# Altium project nPOC-BB_alpha_main-board.PrjPcb (part 2 of 3)

## Sheet Power Supplies.SchDoc: Power Supplies
size 431 x 279 mm; DrawnBy: DD; DocumentNumber: GHL-1-21002; Revision: A; SheetNumber: 4; SheetTotal: 7; ProjectID: 263-03
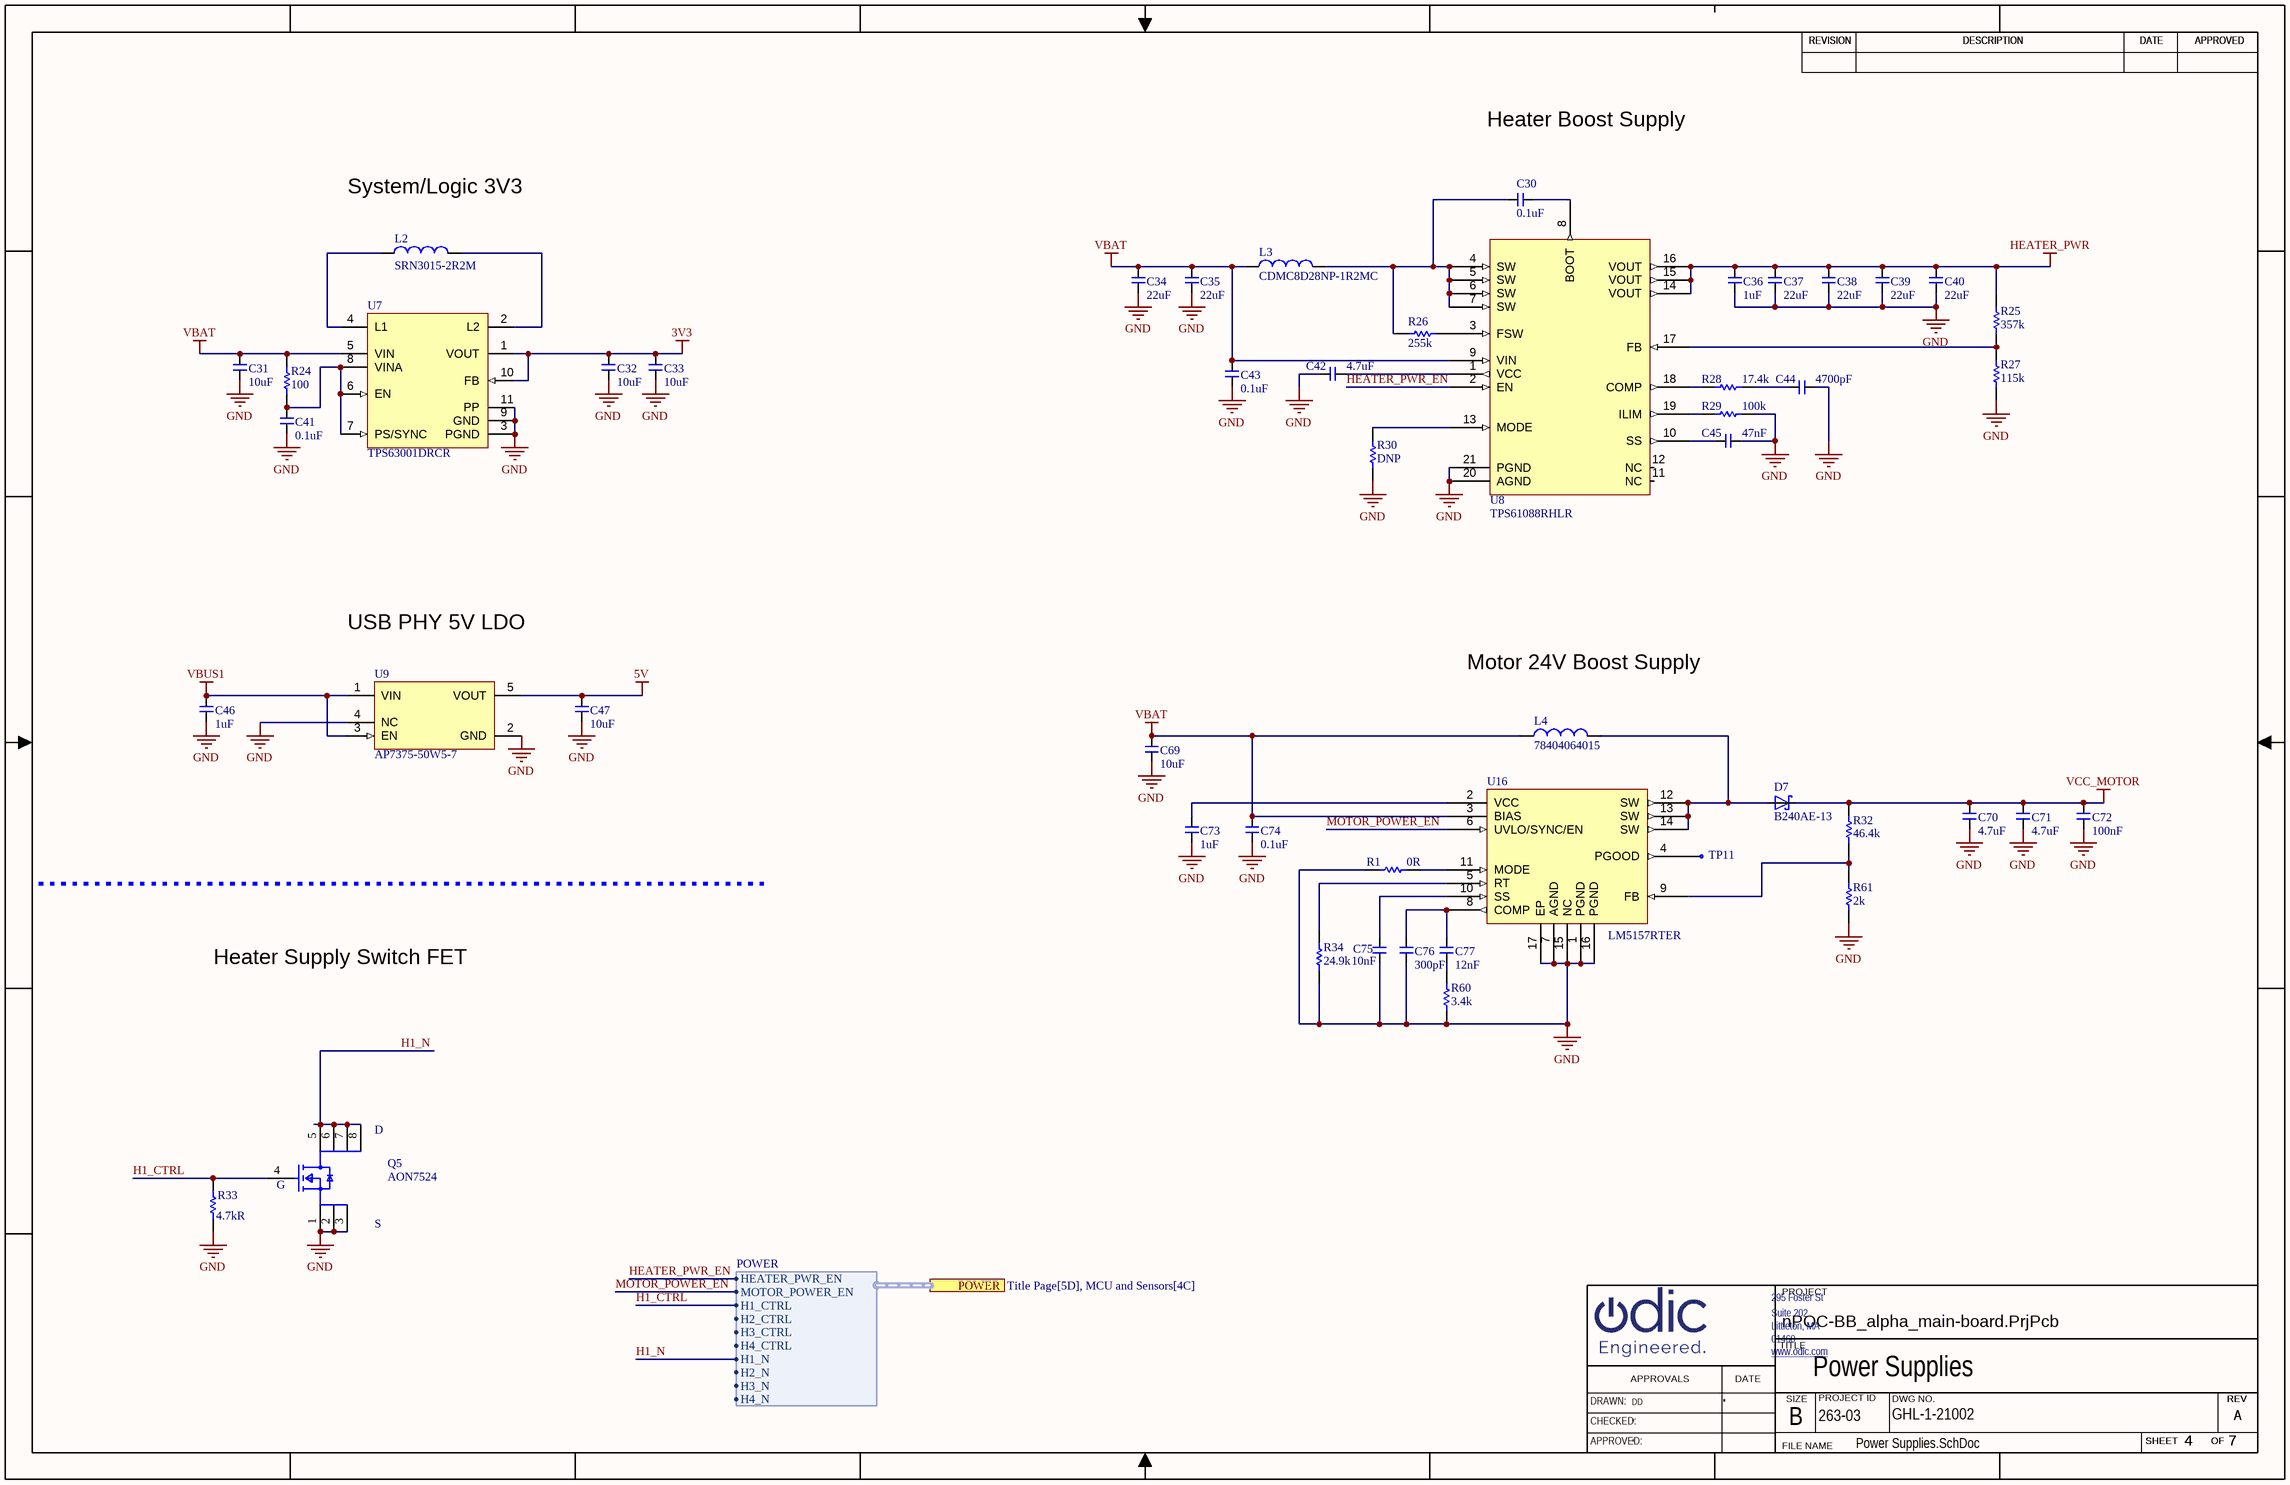
[diagram p4: Power Supplies.SchDoc]

### Parts
C30  0.1uF  [C0402]
C31  10uF  [C0603]
C32  10uF  [C0402]
C33  10uF  [C0402]
C34  22uF  [c0805]
C35  22uF  [c0805]
C36  1uF  [C0603]
C37  22uF  [c0805]
C38  22uF  [c0805]
C39  22uF  [c0805]
C40  22uF  [c0805]
C41  0.1uF  [C0402]
C42  4.7uF  [C0402]
C43  0.1uF  [C0402]
C44  4700pF  [C0402]
C45  47nF  [C0402]
C46  1uF  [C0603]
C47  10uF  [C0402]
C69  10uF  [C0603]
C70  4.7uF  [c0805]
C71  4.7uF  [c0805]
C72  100nF  [C0603]
C73  1uF  [C0603]
C74  0.1uF  [c0805]
C75  value 10nF  [C0402]  (hidden comment: C0402_10n_35V_10pct)
C76  300pF  [C0402]
C77  12nF  [C0402]
D7  B240AE-13  [sma]
L2  SRN3015-2R2M  [IND_BOURNS_SRN3015]
L3  CDMC8D28NP-1R2MC  [ind2_9p5x8p5mm]
L4  78404064015  [ind2_wurth_78404064015]
Q5  AON7524  [dfn8_3x3_p65mm_fet]
R1  0R  [R0402]
R24  100  [R0402]
R25  357k  [R0402]
R26  255k  [R0402]
R27  115k  [R0402]
R28  17.4k  [R0402]
R29  100k  [R0402]
R30  DNP  [R0402]
R32  46.4k  [R0402]
R33  Resistance: 4.7kR  [R0402]  (hidden comment: R0402_4k7_1pct)
R34  24.9k  [R0402]
R60  3.4k  [R0402]
R61  2k  [R0402]
TP11  TPC30  [tpc30]  (value not drawn)
U7  TPS63001DRCR  [dfn10_3x3_p5mm_1mm]
U8  TPS61088RHLR  [qfn20_3p5x4p5_p5mm]
U9  AP7375-50W5-7  [SOT25]
U16  LM5157RTER  [qfn16_3x3_p5mm_thpad]

### Ports
POWER (harness POWER, see Title Page[5D], MCU and Sensors[4C])

### Harnesses
POWER: HEATER_PWR_EN, H1_CTRL, H2_CTRL, H3_CTRL, H4_CTRL, H1_N, H2_N, H3_N, H4_N, MOTOR_POWER_EN

### Nets
3V3: C32.2 C33.2 U7.1(VOUT) U7.10(FB)
5V: C47.2 U9.5(VOUT)
GND: C31.1 C32.1 C33.1 C34.1 C35.1 C36.1 C37.1 C38.1 C39.1 C40.1 C41.1 C42.1 C43.1 C44.2 C45.2 C46.1 C47.1 C69.1 C70.1 C71.1 C72.1 C73.1 C74.1 C75.1 C76.1 Q5.1(S) Q5.2(S) Q5.3(S) R1.1 R27.1 R29.2 R30.1 R33.1 R34.1 R60.1 R61.1 U7.3(PGND) U7.9(GND) U7.11(PP) U8.20(AGND) U8.21(PGND) U9.2(GND) U9.4(NC) U16.1(PGND) U16.7(AGND) U16.15(NC) U16.16(PGND) U16.17(EP)
HEATER_PWR: C36.2 C37.2 C38.2 C39.2 C40.2 R25.2 U8.14(VOUT) U8.15(VOUT) U8.16(VOUT)  [project net HEATER_P]
VBAT: C31.2 C34.2 C35.2 C43.2 C69.2 C74.2 L3.1 L4.1 R24.2 U7.5(VIN) U8.9(VIN) U16.3(BIAS)
VBUS1: C46.2 U9.1(VIN) U9.3(EN)
VCC_MOTOR: C70.2 C71.2 C72.2 D7.K R32.2
H1_CTRL: Q5.4(G) R33.2 ; port POWER.H1_CTRL
H1_N: Q5.5(D) Q5.6(D) Q5.7(D) Q5.8(D) ; port POWER.H1_N
HEATER_PWR_EN: U8.2(EN) ; port POWER.HEATER_PWR_EN
MOTOR_POWER_EN: U16.6(UVLO/SYNC/EN) ; port POWER.MOTOR_POWER_EN
NetC30_1: C30.1 U8.8(BOOT)
NetC30_2: C30.2 L3.2 R26.1 U8.4(SW) U8.5(SW) U8.6(SW) U8.7(SW)
NetC41_2: C41.2 R24.1 U7.6(EN) U7.7(PS/SYNC) U7.8(VINA)
NetC42_2: C42.2 U8.1(VCC)
NetC44_1: C44.1 R28.2
NetC45_1: C45.1 U8.10(SS)
NetC73_2: C73.2 U16.2(VCC)
NetC75_2: C75.2 U16.10(SS)
NetC76_2: C76.2 C77.2 U16.8(COMP)
NetC77_1: C77.1 R60.2
NetD7_A: D7.A L4.2 U16.12(SW) U16.13(SW) U16.14(SW)
NetL2_1: L2.1 U7.4(L1)
NetL2_2: L2.2 U7.2(L2)
NetR1_2: R1.2 U16.11(MODE)
NetR25_1: R25.1 R27.2 U8.17(FB)
NetR26_2: R26.2 U8.3(FSW)
NetR28_1: R28.1 U8.18(COMP)
NetR29_1: R29.1 U8.19(ILIM)
NetR30_2: R30.2 U8.13(MODE)
NetR32_1: R32.1 R61.2 U16.9(FB)
NetR34_2: R34.2 U16.5(RT)
NetTP11_1: TP11.1 U16.4(PGOOD)

Not connected (* = marked no-connect by the designer): U8 11(NC) 12(NC)

### Notes on the sheet
- Heater Boost Supply
- System/Logic 3V3
- USB PHY 5V LDO
- Motor 24V Boost Supply
- Heater Supply Switch FET
- REVISION
- DESCRIPTION
- DATE
- APPROVED
- 295 Foster St
- PROJECT
- www.odic.com <http://www.odic.com>
- Littleton, MA
- 01460
- Suite 202
- TITLE
- DRAWN:
- CHECKED:
- APPROVALS
- SIZE
- B
- PROJECT ID
- DWG NO.
- SHEET
- OF
- REV
- APPROVED:
- FILE NAME

### Library data of the parts
C30 C43 = CMP-00446-1: Ceramic capacitor SMD 0402 100nF 16V X7R 10%; Install: POP; Voltage: 16V; Mounting Technology: Surface Mount; Width: 0.02inch; Case Code (Metric): 1005; Package Quantity: 1; Depth: 0.5mm; RoHS Compliant: Yes; Length: 1mm; Tolerance: 10%; Value: 100nF; Radiation Hardening: No; Contact Plating: Tin; Packaging: Tape and Reel; Voltage Rating (DC): 16V; Thickness: 0.022inch; Case Code (Imperial): 0402; Case/Package: 0402; Min Operating Temperature: -55°C; Max Operating Temperature: 125°C; Voltage Rating: 16V; Height: 0.5mm; Series: CL; Material: Ceramic; Construction: Flat; Lead Free: Lead Free; Dielectric: X7R
C31 C69 = CMP-00294-2: Cap Ceramic 10uF 35V X5R 20% Pad SMD 0603 85C T/R; Install: POP; Case Code (Metric): 1608; Length: 0.063inch; Case Code (Imperial): 0603; Thickness: 0.039inch; Width: 0.031inch; RoHS Compliant: Yes; Voltage Rating: 35V; Dielectric: X5R; Series: GRM; Case/Package: 0603; Voltage Rating (DC): 35V; Mount: Surface Mount; Capacitance: 10uF; Tolerance: 20%; Max Operating Temperature: 85°C; Packaging: Cut Tape; Min Operating Temperature: -55°C
C32 C33 = CMP-00337-1: Cap Ceramic 10uF 6.3V X5R 20% SMD 0402 85°C Paper T/R; Install: POP; Mount: Surface Mount; Construction: Flat; Case Code (Imperial): 0402; Case/Package: 0402; Series: CL; Package Quantity: 1; Width: 0.02inch; Dielectric: X5R; Radiation Hardening: No; Case Code (Metric): 1005; Capacitance: 10uF; RoHS Compliant: Yes; Depth: 0.5mm; Height: 0.5mm; Packaging: Tape and Reel; Min Operating Temperature: -55°C; Tolerance: 20%; Voltage Rating: 6.3V; Max Operating Temperature: 85°C; Thickness: 0.028inch; Length: 1mm
C34 C35 C37-C40 = CMP-00654-4: Multilayer Ceramic Capacitor, 22 uF, 25 V, ± 20%, X5R, 0805 [2012 Metric]; Install: POP; RoHS Compliant: Yes; Capacitance: 22uF
C36 C46 = CMP-001-00011-1: Multilayer Ceramic Capacitors MLCC - SMD/SMT 1uF 50V 0603 RoHS; Tolerance: 10%; Install: POP; Dielectric: X5R; Max Operating Temperature: 85°C; Packaging: Tape and Reel; Termination: SMD/SMT; Width: 0.031inch; Voltage Rating (DC): 50V; Length: 0.063inch; Halogen Free: Halogen Free; Case/Package: 0603; Package Quantity: 4000; Lead Free: Lead Free; Voltage Rating: 50V; Resistor Type: Ceramic; Value: 1uF; Thickness: 0.035inch; Weight: 7.1E-05oz; Min Operating Temperature: -55°C; Case Code (Metric): 1608; Case Code (Imperial): 0603; Mounting Technology: Surface Mount; RoHS Compliant: Yes; Series: CC
C41 = CMP-00369-1: Cap Ceramic 0.1uF 25V X5R 10% Pad SMD 0402 Multi Layer Ceramic Capacitor (MLCC); Capacitance: 100nF; Install: POP; Packaging: Tape and Reel; Construction: Flat; Max Operating Temperature: 85°C; Case Code (Metric): 1005; Voltage Rating (DC): 25V; Min Operating Temperature: -55°C; Height: 0.5mm; Series: CL; Case/Package: 0402; Voltage: 25V; Package Quantity: 1; Radiation Hardening: No; Depth: 0.5mm; Thickness: 0.022inch; Lead Free: Lead Free; Tolerance: 10%; Length: 1mm; Mount: Surface Mount; Width: 0.02inch; Dielectric: X5R; RoHS Compliant: Yes; Voltage Rating: 25V; Case Code (Imperial): 0402
C42 = CMP-00316-1: Cap Ceramic 4.7uF 10V X5R 20% SMD 0402 85°C Paper T/R; Install: POP; Width: 0.02inch; Package Quantity: 10000; Min Operating Temperature: -55°C; Mount: Surface Mount; Case Code (Imperial): 0402; Case/Package: 0402; Capacitance: 4.7uF; Series: CL; Packaging: Cut Tape; Length: 0.039inch; Dielectric: X5R; Voltage Rating: 10V; Thickness: 0.022inch; Tolerance: 20%; Max Operating Temperature: 85°C; RoHS Compliant: Yes; Case Code (Metric): 1005; Lead Free: Lead Free
C44 = CMP-00374-1: 0402 4.7 nF 25 V ±10 % Tolerance X7R SMT Multilayer Ceramic Capacitor; Tolerance: 10%; Voltage Rating: 25V; Install: POP; Insulation Resistance: 100GR; Capacitance: 4.7nF; Halogen Free: Halogen Free; Weight: 2.3E-05oz; Length: 1mm; Number of Pins: 2; Dielectric: X7R; Radiation Hardening: No; Depth: 0.5mm; Mount: Surface Mount; Min Operating Temperature: -55°C; Thickness: 0.022inch; Max Operating Temperature: 125°C; Dielectric Material: Ceramic; Height: 0.5mm; RoHS Compliant: Yes; Package Quantity: 1; Lead Free: Lead Free; Case Code (Metric): 1005; Voltage Rating (DC): 25V; Case/Package: 0402; Reach SVHC Compliant: Yes; Termination: SMD/SMT; Width: 0.5mm; Resistor Type: Ceramic; Packaging: Tape and Reel; Case Code (Imperial): 0402; Series: CC; Construction: Flat
C45 = CMP-00644-3: CGA2B3X7R1H473K050BB; Voltage Rating: 50V; Tolerance: 10%; Install: POP; Dielectric: X7R; Voltage Rating (DC): 50V; Package Quantity: 1; Width: 0.02inch; Mount: Surface Mount; Case/Package: 0402; Case Code (Metric): 1005; Depth: 0.5mm; Thickness: 0.022inch; Case Code (Imperial): 0402; Capacitance: 47nF; Termination: SMD/SMT; Min Operating Temperature: -55°C; RoHS Compliant: Yes; Reach SVHC Compliant: No; Height: 0.5mm; Construction: Flat; Length: 1mm; Max Operating Temperature: 125°C; Lead Free: Lead Free; Ratings: AEC-Q200; Series: CGA; Weight: 2.3E-05oz; Packaging: Tape and Reel
C47 = CMP-00507-2: Ceramic capacitor SMD; 0402; 10uF; 10V; X5R; 20%; Install: POP; Capacitance: 10uF; Dielectric: X5R; Tolerance: 20%; Voltage Rating: 10V; Case Code (Imperial): 0402
C70 C71 = CMP-001-00030-1: Multilayer Ceramic Capacitor, 4.7 uF, 35 V, ± 10%, X7S, 0805 [2012 Metric]; Voltage Rating: 50V; Dielectric: X5R; Install: POP; Value: 4.7uF; Thickness: 0.055inch; Case/Package: 0805; Tolerance: 10%; Max Operating Temperature: 85°C; Depth: 1.25mm; Package Quantity: 1; Voltage Rating (DC): 50V; Min Operating Temperature: -55°C; Length: 2mm; Case Code (Metric): 2012; Width: 0.049inch; Packaging: Tape and Reel; RoHS Compliant: Yes; Mounting Technology: Surface Mount; Case Code (Imperial): 0805; Radiation Hardening: No; Material: Ceramic; Series: CL
C72 = CMP-00293-3: CAP CER 0.1UF 50V X7R 0603; Tolerance: 10%; Install: POP; Termination: Wraparound; Length: 0.063inch; Dielectric: X7R; RoHS Compliant: Yes; Case Code (Metric): 1608; Packaging: Cut Tape; Voltage Rating: 50V; Max Operating Temperature: 125°C; Mount: Surface Mount; Case Code (Imperial): 0603; Capacitance: 100nF; Thickness: 0.035inch; Width: 0.031inch; Series: CL; Construction: Flat; Case/Package: 0603; Contact Plating: Tin; Package Quantity: 1; Min Operating Temperature: -55°C
C73 = CMP-00296-2: CAP CER 1UF 16V X5R 0603; Tolerance: 10%; Install: POP; Material: Ceramic; Length: 1.6mm; Packaging: Tape and Reel; Width: 0.031inch; Voltage Rating: 16V; Construction: Flat; Package Quantity: 1; RoHS Compliant: Yes; Series: CL; Thickness: 0.035inch; Capacitance: 1uF; Min Operating Temperature: -55°C; Case/Package: 0603; Height: 0.8mm; Lead Free: Lead Free; Dielectric: X5R; Depth: 0.8mm; Radiation Hardening: No; Contact Plating: Tin; Voltage: 16V; Mount: Surface Mount; Voltage Rating (DC): 16V; Case Code (Metric): 1608; Max Operating Temperature: 85°C; Case Code (Imperial): 0603
C74 = CMP-00748-2: Cap Cer 0.1UF 25V X7R 0805; Tolerance: 10%; Capacitance: 0.1 uF; Maximum Voltage: 25V
C75 = CMP-00724-2: Multilayer Ceramic Capacitor, 0.01 uF, 35 V, ± 10%, X7R, 0402 [1005 Metric]; Voltage Rating (DC): 35V; Install: POP; Packaging: Tape and Reel; Voltage Rating: 35V; Height: 0.5mm; Package Quantity: 1; Max Operating Temperature: 125°C; Length: 1mm; Width: 0.02inch; RoHS Compliant: Yes; Case/Package: 0402; Weight: 2.3E-05oz; Thickness: 0.022inch; Reach SVHC Compliant: No; Tolerance: 10%; Min Operating Temperature: -55°C; Mounting Technology: Surface Mount; Termination: SMD/SMT; Case Code (Metric): 1005; Dielectric: X7R; Series: CGA; Case Code (Imperial): 0402; Depth: 0.5mm; Ratings: AEC-Q200
C76 = CMP-00937-1: Cap Ceramic 300pF 50V C0G 5% SMD 0402 125°C Paper T/R; Value: 300pF; Case Code (Metric): 1005; Min Operating Temperature: -55°C; Max Operating Temperature: 125°C; Pins: 2; Voltage Rating: 50V; Material: Ceramic; Series: SMD Comm C0G; Tolerance: 5%; Voltage Rating (DC): 50V; RoHS Compliant: Yes; Lead Free: Lead Free; Packaging: Cut Tape; Case/Package: 0402; Dielectric Material: Ceramic; Case Code (Imperial): 0402
C77 = CMP-001-00029-1: 0402 12 nF 16 V ±10% Tolerance X7R SMT Multilayer Ceramic Capacitor; Voltage: 16V; Install: POP; Case Code (Metric): 1005; Width: 0.5mm; Dielectric: X7R; Case Code (Imperial): 0402; Packaging: Tape and Reel; Voltage Rating: 16V; Pins: 2; RoHS Compliant: Yes; Lead Free: Lead Free; Mounting Technology: Surface Mount; Depth: 0.5mm; Material: Ceramic; Series: GRM; Voltage Rating (DC): 16V; Package Quantity: 1; Thickness: 0.022inch; Radiation Hardening: No; Value: 12nF; Min Operating Temperature: -55°C; Max Operating Temperature: 125°C; Length: 1mm; Termination: SMD/SMT; Tolerance: 10%; Case/Package: 0402; Construction: Flat; Height: 0.5mm
D7 = CMP-004-00003-5: Diode Schottky 40V 2A 2-Pin DO-214AC T/R; Install: POP; Case/Package: SMA; Average Rectified Current: 2A; Mount: Surface Mount; Packaging: Tape and Reel; RoHS Compliant: Yes; Max Reverse Voltage (DC): 40V
L2 = CMP-006-00004-2: Ind Power Semi-Shielded Wirewound 2.2uH 20% 1MHz Ferrite 1.8A 1212 T/R; DC Resistance (DCR): 72mR; Saturation Current: 1.65A; Material: Steel; Self Resonant Frequency: 90MHz; Install: POP; Inductance Tolerance: 20%; Reach SVHC Compliant: No; Tolerance: 20%; Max DC Current: 1.8A; Core Material: Ferrite; Military Standard: Not; Max Operating Temperature: 125°C; Sample Rate (Hz): 1MHz; Termination: SMD/SMT; RMS Current (Irms): 1.8A; Case/Package: 1212; Weight: 0.001235oz; Frequency: 90MHz; Value: 2.2uH; Current Rating: 1.8A; Shielding: Shielded; Packaging: Tape and Reel; Pins: 2; Height - Seated (Max): 0.059inch; DC Current: 1.8A; Package Quantity: 2000; Height: 1.5mm; Min Operating Temperature: -40°C; Width: 3mm; Length: 3mm; Depth: 3.1mm; Test Frequency: 1MHz; Series: SRN3015; Radiation Hardening: No
L3 = CMP-00929-2: Inductor Power Shielded Wirewound 1.2uH 20% 1MHz 12.9A 0.007Ohm DCR T/R; Core Material: Metal,Composite; Install: POP; Saturation Current: 12.2A; DC Resistance (DCR): 7mR; Tolerance: 20%; Packaging: Tape and Reel; Radiation Hardening: No; Min Operating Temperature: -40°C; Mounting Technology: Surface Mount; Termination: SMD/SMT; Max Operating Temperature: 125°C; Max DC Current: 12.9A; Depth: 8.7mm; Case/Package: Nonstandard; Series: CDMC8D28; Length: 9.5mm; Value: 1.2uH; Package Quantity: 1000; RoHS Compliant: Yes; Height: 3mm; Width: 8.7mm; Test Frequency: 1MHz; Shielding: Shielded
L4 = CMP-00936-2: WE-LQSA SMT Semi-Shielded Power Inductor 1.5uH 6.1 A 13mOhm Max; Install: POP
Q5 = CMP-00921-2: Trans Mosfet N-ch 30V 28A 8-PIN Dfn-a Ep; Max Power Dissipation: 32W; Input Capacitance: 2.25nF; Rds On Max: 3.3mR; Install: POP; Series: AlphaMOS; Drain to Source Voltage (Vdss): 30V; Mounting Technology: Surface Mount; Continuous Drain Current (ID): 28A; RoHS Compliant: Yes; Case/Package: DFN; Max Operating Temperature: 150°C; Packaging: Cut Tape; Min Operating Temperature: -55°C
R1 = CMP-00319-1: RES 0 OHM JUMPER 1/16W 0402; Max Power Dissipation: 63mW; Install: POP; Working Voltage: 50V; Current Rating: 1A; Case/Package: 0402; Max Operating Temperature: 155°C; Contact Plating: Tin,Matte; Height: 0.016inch; RoHS Compliant: Yes; Lead Free: Lead Free; Length: 0.039inch; Case Code (Imperial): 0402; Resistor Type: Thick Film; Military Standard: Not; Width: 0.02inch; Construction: Rectangular; Features: Automotive AEC-Q200; Depth: 0.5mm; Case Code (Metric): 1005; Technology: THICK FILM; Number of Terminations: 2; Power Rating: 63mW; Radiation Hardening: No; Min Operating Temperature: -55°C; Series: RMCF; Packaging: Tape and Reel; Mount: Surface Mount; Resistance: 0R
R24 = CMP-009-00016-1: Res General Purpose Thick Film 0402 100 Ohm 1% 1/16W ±200ppm/°C Molded SMD Paper T/R; Voltage Rating (DC): 50V; Power Rating: 62.5mW; Value: 100R; Install: POP; Max Power Dissipation: 63mW; Temperature Coefficient: 100ppm/°C; Reach SVHC Compliant: No; Construction: Rectangular; Case/Package: 0402; Military Standard: Not; Lead Free: Lead Free; Number of Terminations: 2; Case Code (Metric): 1005; Pins: 2; Width: 0.5mm; Features: Moisture Resistant; Tolerance: 1%; Packaging: Tape and Reel; Depth: 0.5mm; Technology: THICK FILM; Series: RC; Min Operating Temperature: -55°C; Height: 0.32mm; RoHS Compliant: Yes; Max Operating Temperature: 155°C; Voltage Rating: 50V; Case Code (Imperial): 0402; Resistance Tolerance: 1%; Termination: SMD/SMT; Resistor Type: Thick Film; Length: 1mm
R25 = CMP-009-00041-1: Res Thick Film 0402 357K Ohm 1% 0.1W ±100ppm/°C Molded SMD Punched Carrier T/R; Install: POP; Value: 357kR; Voltage Rating (DC): 50V; Max Power Dissipation: 100mW; Features: Automotive AEC-Q200; Reach SVHC Compliant: No; Resistor Type: Thick Film; Series: ERJ; Case/Package: 0402; Contact Plating: Tin; Tolerance: 1%; Max Operating Temperature: 155°C; Termination: SMD/SMT; Number of Terminations: 2; Military Standard: Not; Lead Free: Contains Lead; Min Operating Temperature: -55°C; Case Code (Metric): 1005; Resistance Tolerance: 1%; Length: 1mm; Construction: Rectangular; Technology: THICK FILM; Height: 0.35mm; Voltage Rating: 50V; Case Code (Imperial): 0402; Power Rating: 100mW; Package Quantity: 10000; Width: 0.5mm; RoHS Compliant: Yes; Mounting Technology: Surface Mount; Temperature Coefficient: 100ppm/°C; Packaging: Tape and Reel; Ratings: AEC-Q200; Depth: 0.5mm
R26 = CMP-009-00038-1: SMD Chip Resistor, 255 kOhm, ± 1%, 100 mW, 0402 [1005 Metric], Thick Film, Precision; Install: POP; Max Power Dissipation: 100mW; Voltage Rating (DC): 50V; Temperature Coefficient: 100ppm/°C; Value: 255kR; Termination: SMD/SMT; Features: Automotive AEC-Q200; Mounting Technology: Surface Mount; Width: 0.5mm; Series: ERJ; Case Code (Imperial): 0402; Min Operating Temperature: -55°C; Height: 0.35mm; Technology: THICK FILM; Depth: 0.5mm; Military Standard: Not; Construction: Rectangular; Package Quantity: 10000; Lead Free: Lead Free; Tolerance: 1%; Case Code (Metric): 1005; Case/Package: 0402; Ratings: AEC-Q200; Voltage Rating: 50V; Number of Terminations: 2; RoHS Compliant: Yes; Resistor Type: Thick Film; Reach SVHC Compliant: No; Power Rating: 100mW; Length: 1mm; Max Operating Temperature: 155°C; Contact Plating: Tin; Resistance Tolerance: 1%; Packaging: Tape and Reel
R27 = CMP-009-00040-1: SMD Chip Resistor, 115 kOhm, ± 1%, 100 mW, 0402 [1005 Metric], Thick Film, Precision; Temperature Coefficient: 100ppm/°C; Voltage Rating: 50V; Value: 115kR; Max Power Dissipation: 100mW; Install: POP; Width: 0.5mm; Depth: 0.5mm; Weight: 2.8E-05oz; Military Standard: Not; Max Operating Temperature: 155°C; Reach SVHC Compliant: No; Lead Free: Lead Free; Series: ERJ; Termination: SMD/SMT; Tolerance: 1%; RoHS Compliant: Yes; Case/Package: 0402; Features: Automotive AEC-Q200; Length: 1mm; Mounting Technology: Surface Mount; Voltage Rating (DC): 50V; Technology: THICK FILM; Min Operating Temperature: -55°C; Construction: Rectangular; Number of Terminations: 2; Resistor Type: Thick Film; Case Code (Imperial): 0402; Height: 0.35mm; Resistance Tolerance: 1%; Case Code (Metric): 1005; Packaging: Tape and Reel; Package Quantity: 10000; Power Rating: 100mW; Contact Plating: Tin; Ratings: AEC-Q200
R28 = CMP-009-00039-1: Res Thick Film 0402 17.4K Ohm 1% 1/10W ±100ppm/°C Molded SMD Punched Carrier T/R; Power Rating: 100mW; Voltage Rating: 50V; Install: POP; Value: 17.4kR; Technology: THICK FILM; Ratings: AEC-Q200; Max Operating Temperature: 155°C; Min Operating Temperature: -55°C; Packaging: Tape and Reel; Height: 0.35mm; Resistor Type: Thick Film; Resistance Tolerance: 1%; Number of Terminations: 2; Reach SVHC Compliant: Yes; Termination: SMD/SMT; Package Quantity: 10000; Case Code (Metric): 1005; Lead Free: Lead Free; Depth: 0.5mm; Features: Automotive AEC-Q200; Series: ERJ; Case/Package: 0402; Case Code (Imperial): 0402; Temperature Coefficient: 100ppm/°C; Width: 0.5mm; Tolerance: 1%; Max Power Dissipation: 100mW; Mounting Technology: Surface Mount; Length: 1mm; RoHS Compliant: Yes; Radiation Hardening: No; Voltage Rating (DC): 50V; Contact Plating: Tin
R29 = CMP-00351-1: Res General Purpose Thick Film 0402 100K Ohm 1% 1/16W ±100ppm/°C Molded SMD Paper T/R; Working Voltage: 50V; Resistance: 100kR; Install: POP; Power Rating: 63mW; Series: RC; Military Standard: Not; Case Code (Metric): 1005; Features: Moisture Resistant; Termination: SMD/SMT; Number of Terminations: 2; Temperature Coefficient: 100ppm/°C; Height: 0.016inch; Tolerance: 1%; Case/Package: 0402; Depth: 0.5mm; RoHS Compliant: Yes; Resistance Tolerance: 1%; Lead Free: Lead Free; Max Operating Temperature: 155°C; Min Operating Temperature: -55°C; Width: 0.02inch; Packaging: Tape and Reel; Technology: THICK FILM; Case Code (Imperial): 0402; Package Quantity: 1; REACH SVHC: No SVHC; Resistor Type: Thick Film; Max Power Dissipation: 63mW; Voltage Rating: 50V; Length: 0.039inch; Construction: Rectangular
R30 = CMP-00015-3: Unpopulated 0402 pads. No part number associated with this "component"; Install: DNP; Odic Footprint: R0402
R32 = CMP-009-00044-1: Resistor, Metal Glaze/Thick Film, 0.1 W, 1 %, 100 Ppm, 46400 Ohm, Surface Mount, 0402; Install: POP; Value: 46.4kR; Tolerance: 1%; Power Rating: 100mW; Voltage Rating: 50V; Temperature Coefficient: 100ppm/°C; Height: 0.35mm; Number of Terminations: 2; Package Quantity: 10000; Termination: SMD/SMT; Depth: 0.5mm; Series: ERJ; Case Code (Imperial): 0402; RoHS Compliant: Yes; Resistance Tolerance: 1%; Max Operating Temperature: 155°C; Technology: THICK FILM; Case/Package: 0402; Packaging: Tape and Reel; Ratings: AEC-Q200; Lead Free: Lead Free; Mounting Technology: Surface Mount; Length: 1mm; Voltage Rating (DC): 50V; Features: Automotive AEC-Q200; Min Operating Temperature: -55°C; Contact Plating: Tin; Reach SVHC Compliant: No; Max Power Dissipation: 100mW; Radiation Hardening: No; Width: 0.5mm; Case Code (Metric): 1005; Resistor Type: Thick Film
R33 = CMP-00336-2: RES 4.7K OHM 1% 1/16W 0402; Install: POP; Temperature Coefficient: 100ppm/°C; Voltage Rating: 50V; Max Power Dissipation: 63mW; Power Rating: 62.5mW; Features: Moisture Resistant; Length: 1mm; REACH SVHC: No SVHC; RoHS Compliant: Yes; Military Standard: Not; Size Code: 0402; Series: RC; Width: 0.5mm; Lead Free: Lead Free; Max Operating Temperature: 155°C; Height: 0.32mm; Voltage Rating (DC): 50V; Construction: Rectangular; Packaging: Tape and Reel; Tolerance: 1%; Case Code (Metric): 1005; Case Code (Imperial): 0402; Number of Pins: 2; Resistor Type: Thick Film; Number of Terminations: 2; Termination: SMD/SMT; Min Operating Temperature: -55°C; Case/Package: 0402; Height - Seated (Max): 0.016inch; Resistance Tolerance: 1%; Depth: 0.5mm
R34 = CMP-00939-1: Res Thick Film 0402 24.9K Ohm 1% 1/10W ±100ppm/|C SMD Punched Carrier T/R; Power Rating: 100mW; Voltage Rating: 50V; Temperature Coefficient: 100ppm/°C; Value: 24.9kR; Install: POP; Tolerance: 1%; Package Quantity: 1; Series: ERJ; Case/Package: 0402; Resistance Tolerance: 1%; Features: Automotive AEC-Q200; Weight: 2.8E-05oz; Construction: Rectangular; Termination: SMD/SMT; Packaging: Tape and Reel; Min Operating Temperature: -55°C; Mounting Technology: Surface Mount; Military Standard: Not; Number of Terminations: 2; Width: 0.5mm; Max Power Dissipation: 100mW; Contact Plating: Tin; Depth: 0.5mm; Case Code (Imperial): 0402; RoHS Compliant: Yes; Max Operating Temperature: 155°C; Ratings: AEC-Q200; Lead Free: Lead Free; Length: 1mm; Case Code (Metric): 1005; Reach SVHC Compliant: No; Resistor Type: Thick Film; Voltage Rating (DC): 50V; Height: 0.016inch
R60 = CMP-00938-1: SMD Chip Resistor, 3.4 kOhm, ± 1%, 100 mW, 0402 [1005 Metric], Thick Film, Precision; Value: 3.4kR; Max Power Dissipation: 100mW; Temperature Coefficient: 100ppm/°C; Install: POP; Voltage Rating (DC): 50V; Ratings: AEC-Q200; Tolerance: 1%; Min Operating Temperature: -55°C; Height: 0.016inch; Number of Terminations: 2; Package Quantity: 1; Width: 0.5mm; Length: 0.039inch; Weight: 2.8E-05oz; Case Code (Imperial): 0402; Lead Free: Contains Lead; RoHS Compliant: Yes; Max Operating Temperature: 155°C; Termination: SMD/SMT; Case/Package: 0402; Features: Automotive AEC-Q200; Resistance Tolerance: 1%; Resistor Type: Thick Film; Contact Plating: Tin; Reach SVHC Compliant: No; Mounting Technology: Surface Mount; Packaging: Tape and Reel; Case Code (Metric): 1005; Series: ERJ; Power Rating: 100mW; Voltage Rating: 50V
R61 = CMP-00390-1: Res General Purpose Thick Film 0402 2K Ohm 1% 1/16W ±100ppm/°C Molded SMD Paper T/R; Voltage Rating (DC): 50V; Power Rating: 63mW; Install: POP; Resistance: 2kR; Case/Package: 0402; Lead Free: Lead Free; Min Operating Temperature: -55°C; Number of Terminations: 2; Termination: SMD/SMT; Resistor Type: Thick Film; Case Code (Metric): 1005; Temperature Coefficient: 100ppm/°C; Width: 0.02inch; Depth: 0.5mm; Case Code (Imperial): 0402; RoHS Compliant: Yes; Working Voltage: 50V; Max Power Dissipation: 63mW; Military Standard: Not; Series: RC; Height: 0.016inch; Construction: Rectangular; Packaging: Tape and Reel; Length: 0.039inch; Tolerance: 1%; Resistance Tolerance: 1%; Technology: THICK FILM; Max Operating Temperature: 155°C; Package Quantity: 1; Features: Moisture Resistant; Voltage Rating: 50V
TP11 = CMP-00021-3: Test Point Circle 30; Install: DNP
U7 = CMP-00623-7: IC REG BUCK BST 3.3V 1.6A 10SON, FIXED 3.3V; Output Current: 1.2A; Switching Frequency: 1.5MHz; Max Supply Voltage: 5.5V; Install: POP; Synchronous Rectifier: Yes; Efficiency: 96%; Topology: Buck-Boost; Number of Outputs: 1; Min Input Voltage: 1.8V; Quiescent Current: 30uA; Package Quantity: 1; Max Output Voltage: 3.3V; Series: -; Reach SVHC Compliant: No; Min Output Voltage: 3.3V; Packaging: Tape and Reel; Nominal Output Voltage: 3.3V; Radiation Hardening: No; Weight: 0.000921oz; Max Operating Temperature: 85°C; Operating Supply Voltage: 5.5V; Pins: 10; Min Operating Temperature: -40°C; Output Voltage: 3.3V; Lead Free: Lead Free; Max Output current: 1.2A; Output Type: Fixed; RoHS Compliant: Yes; Case/Package: VSON
U8 = CMP-00928-2: IC REG BOOST ADJ 10A SYNC 20VQFN; Quiescent Current: 110uA; Efficiency: 91%; Install: POP; Switching Frequency: 2.2MHz; Max Output Voltage: 12.6V; Synchronous Rectifier: Yes; Output Type: Adjustable; Max Supply Voltage: 12V; Output Configuration: Positive; Min Input Voltage: 2.7V; Min Output Voltage: 4.5V; Number of Outputs: 1; Mounting Technology: Surface Mount; Output Current: 10A; Packaging: Cut Tape; Case/Package: VQFN; Lead Free: Lead Free; Output Voltage: 12.6V; Min Operating Temperature: -40°C; RoHS Compliant: Yes; Topology: Boost; Operating Supply Voltage: 12V; Max Operating Temperature: 85°C; Series: -; Pins: 20; Max Output current: 10A
U9 = CMP-058-000001-1: Fixed 5V LDO Voltage Regulators LDO CMOS LowCurr SOT23 TR 3K; Install: POP; Output Voltage: 5V
U16 = CMP-00935-2: 6A/4A, 50-V, 2.2-MHz wide VIN boost, flyback, & SEPIC converter with dual random spread spectrum 16-WQFN -40 to 125; Install: POP

## Sheet Peripherals.SchDoc: Peripherals
size 431 x 279 mm; DrawnBy: DD; DocumentNumber: GHL-1-21002; Revision: A; SheetNumber: 6; SheetTotal: 7; ProjectID: 263-03
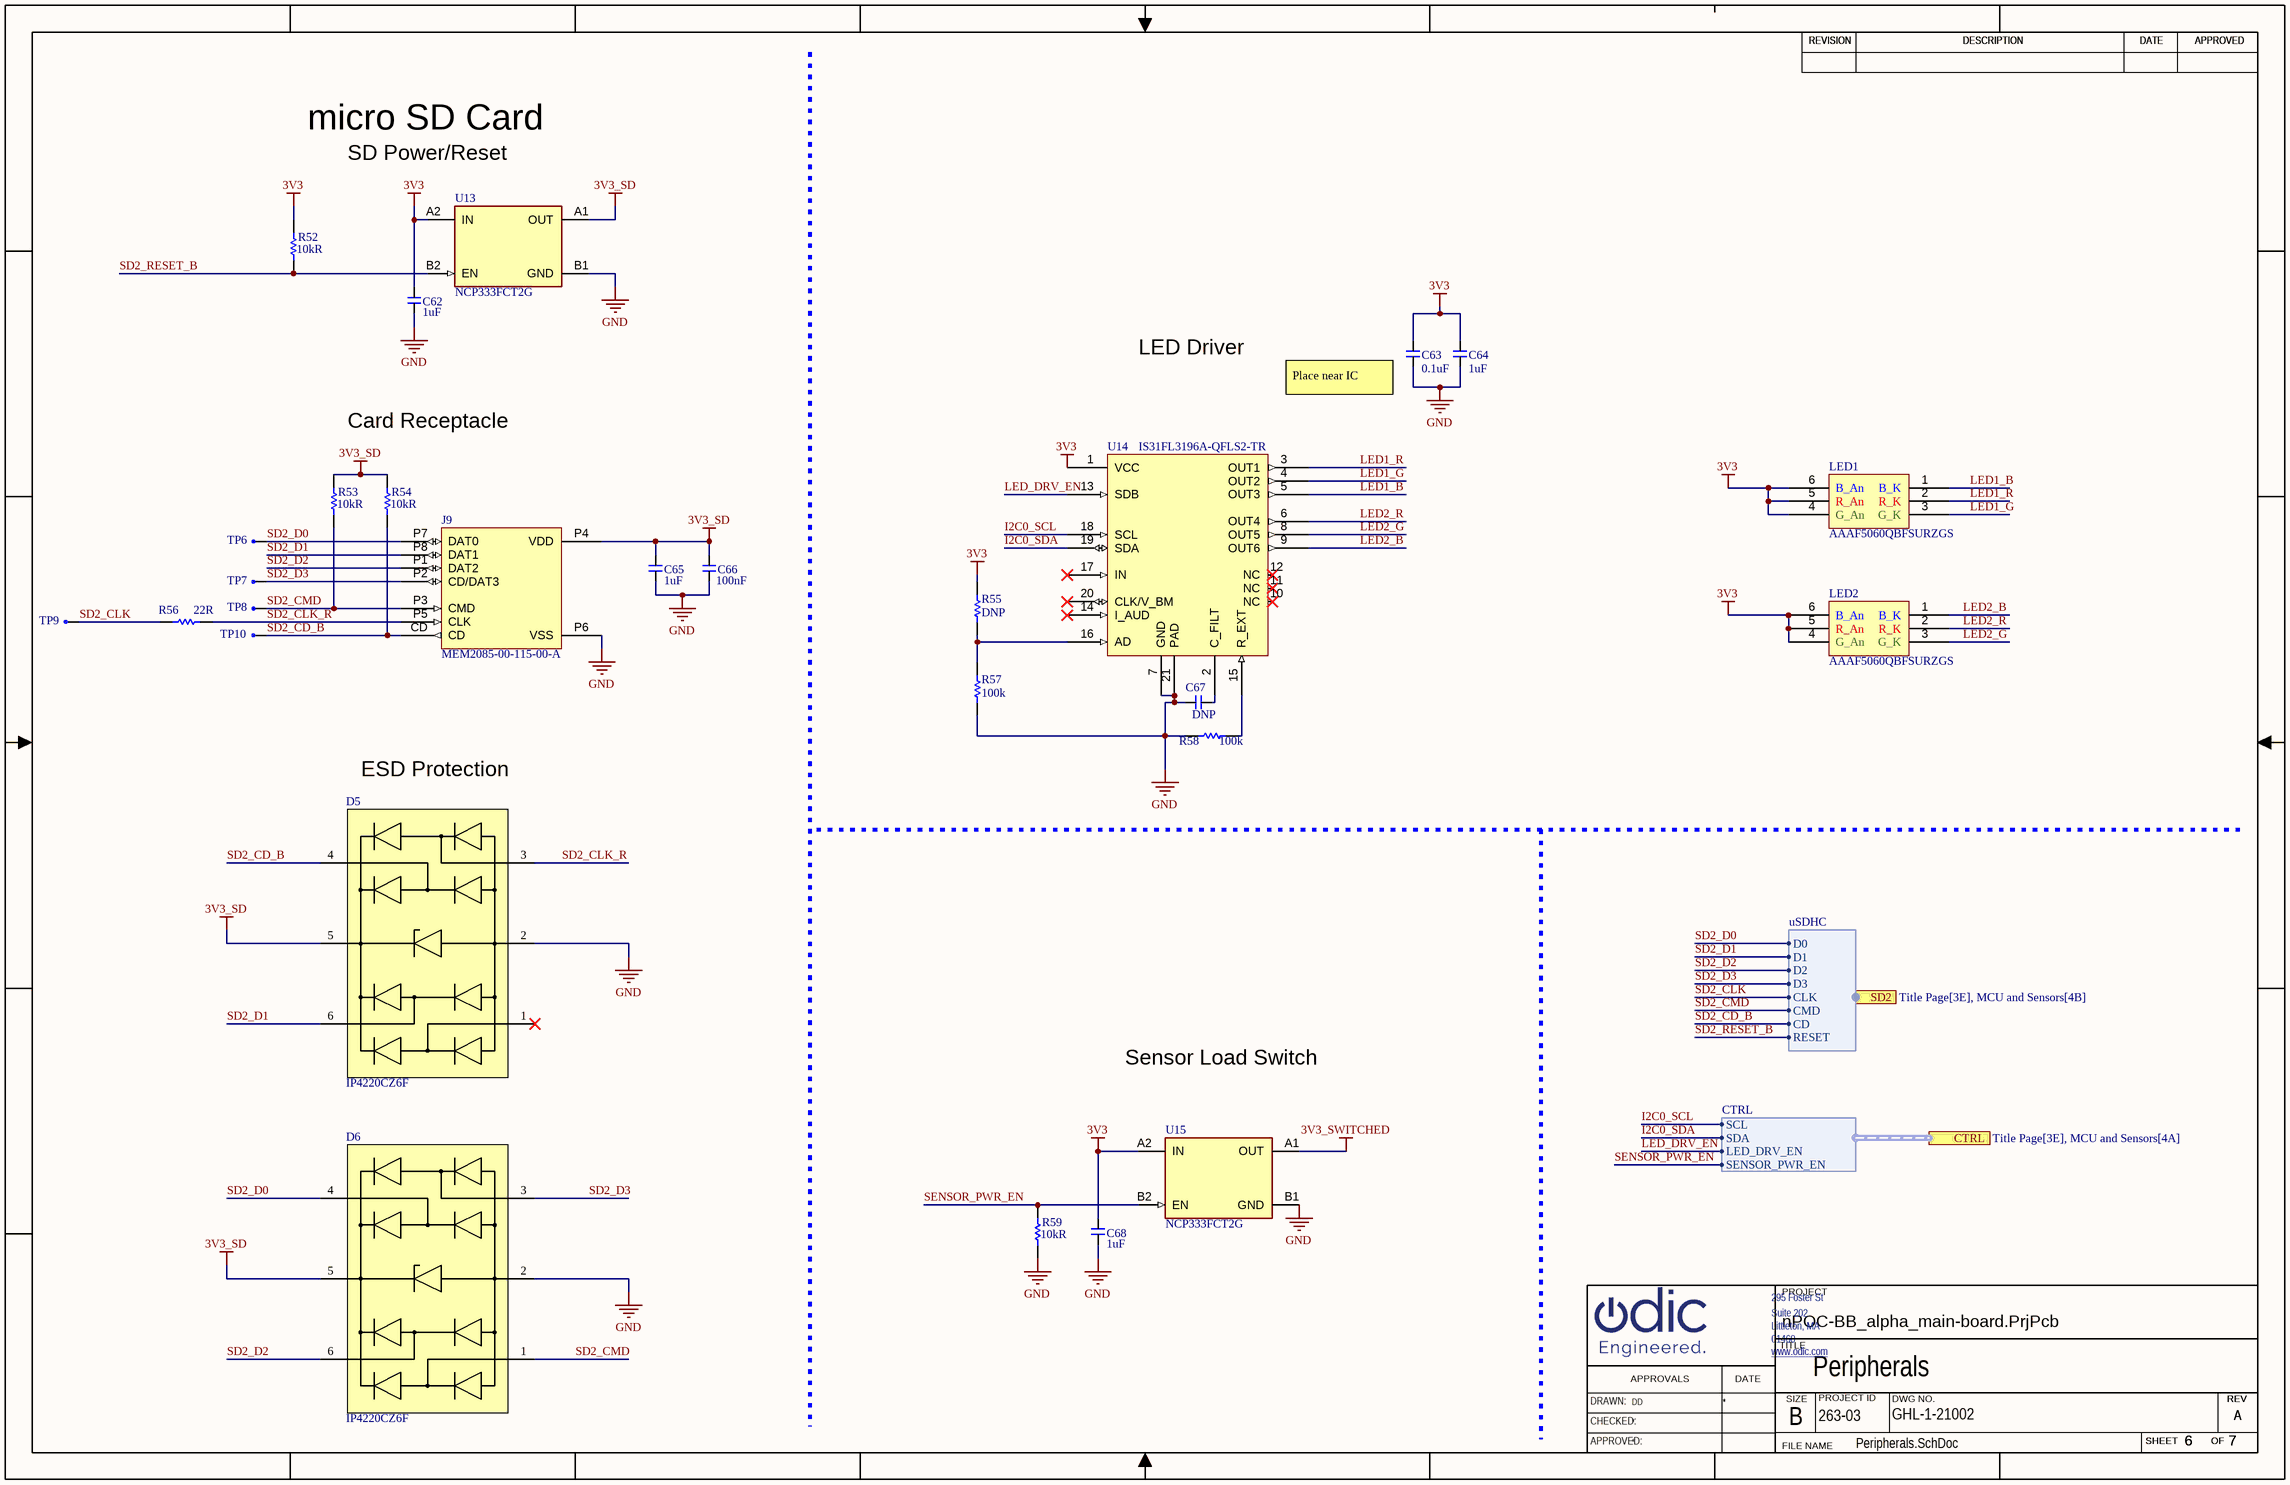
[diagram p5: Peripherals.SchDoc]

### Parts
C62  Capacitance: 1uF  [C0402]  (hidden comment: C0402_1u_6V3_10pct)
C63  0.1uF  [C0402]
C64  1uF  [C0402]
C65  Capacitance: 1uF  [C0402]  (hidden comment: C0402_1u_6V3_10pct)
C66  value 100nF  [C0402]  (hidden comment: C0402_0u1_16V_10pct)
C67  Install: DNP  [C0603]  (hidden comment: N/A)
C68  Capacitance: 1uF  [C0402]  (hidden comment: C0402_1u_6V3_10pct)
D5  IP4220CZ6F  [SOT23-6PIN]
D6  IP4220CZ6F  [SOT23-6PIN]
J9  MEM2085-00-115-00-A  [GCT_MEM2085-00-115-00-A_REV0.2]
LED1  AAAF5060QBFSURZGS  [led6_smt_5x6mm]
LED2  AAAF5060QBFSURZGS  [led6_smt_5x6mm]
R52  Resistance: 10kR  [R0402]  (hidden comment: R0402_10k_1pct)
R53  Resistance: 10kR  [R0402]  (hidden comment: R0402_10k_1pct)
R54  Resistance: 10kR  [R0402]  (hidden comment: R0402_10k_1pct)
R55  DNP  [R0402]
R56  Resistance: 22R  [R0402]  (hidden comment: R0402_22R_1pct)
R57  100k  [R0402]
R58  100k  [R0402]
R59  Resistance: 10kR  [R0402]  (hidden comment: R0402_10k_1pct)
TP6  TPC30  [tpc30]  (value not drawn)
TP7  TPC30  [tpc30]  (value not drawn)
TP8  TPC30  [tpc30]  (value not drawn)
TP9  TPC30  [tpc30]  (value not drawn)
TP10  TPC30  [tpc30]  (value not drawn)
U13  NCP333FCT2G  [bga4_p743xp743_p4mm]
U14  IS31FL3196A-QFLS2-TR  [qfn20_3x3_p4mm]
U15  NCP333FCT2G  [bga4_p743xp743_p4mm]

### Ports
CTRL (harness CTRL, see Title Page[3E], MCU and Sensors[4A]), SD2 (harness uSDHC, see Title Page[3E], MCU and Sensors[4B])

### Harnesses
CTRL: SCL, SDA, LED_DRV_EN, SENSOR_PWR_EN
uSDHC: D0, D1, D2, D3, CLK, CMD, CD, RESET

### Nets
3V3: C62.2 C63.2 C64.2 C68.2 LED1.4(G_An) LED1.5(R_An) LED1.6(B_An) LED2.4(G_An) LED2.5(R_An) LED2.6(B_An) R52.1 R55.2 U13.A2(IN) U14.1(VCC) U15.A2(IN)
3V3_SD: C65.2 C66.2 D5.5(VP) D6.5(VP) J9.P4(VDD) R53.1 R54.1 U13.A1(OUT)
3V3_SWITCHED: U15.A1(OUT)
GND: C62.1 C63.1 C64.1 C65.1 C66.1 C67.2 C68.1 D5.2(GND) D6.2(GND) J9.P6(VSS) R57.1 R58.2 R59.2 U13.B1(GND) U14.7(GND) U14.21(PAD) U15.B1(GND)
I2C0_SCL: U14.18(SCL) ; port CTRL.SCL
I2C0_SDA: U14.19(SDA) ; port CTRL.SDA
LED1_B: LED1.1(B_K) U14.5(OUT3)
LED1_G: LED1.3(G_K) U14.4(OUT2)
LED1_R: LED1.2(R_K) U14.3(OUT1)
LED2_B: LED2.1(B_K) U14.9(OUT6)
LED2_G: LED2.3(G_K) U14.8(OUT5)
LED2_R: LED2.2(R_K) U14.6(OUT4)
LED_DRV_EN: U14.13(SDB) ; port CTRL.LED_DRV_EN
SD2_CD_B: D5.4(I/O3) J9.CD R54.2 TP10.1 ; port SD2.CD
SD2_CLK: R56.1 TP9.1 ; port SD2.CLK
SD2_CLK_R: D5.3(I/O2) J9.P5(CLK) R56.2
SD2_CMD: D6.1(I/O1) J9.P3(CMD) R53.2 TP8.1 ; port SD2.CMD
SD2_D0: D6.4(I/O3) J9.P7(DAT0) TP6.1 ; port SD2.D0
SD2_D1: D5.6(I/O4) J9.P8(DAT1) ; port SD2.D1
SD2_D2: D6.6(I/O4) J9.P1(DAT2) ; port SD2.D2
SD2_D3: D6.3(I/O2) J9.P2(CD/DAT3) TP7.1 ; port SD2.D3
SD2_RESET_B: R52.2 U13.B2(EN) ; port SD2.RESET
SENSOR_PWR_EN: R59.1 U15.B2(EN) ; port CTRL.SENSOR_PWR_EN
NetC67_1: C67.1 U14.2(C_FILT)
NetR55_1: R55.1 R57.2 U14.16(AD)
NetR58_1: R58.1 U14.15(R_EXT)

Not connected (* = marked no-connect by the designer): D5 1(I/O1)*; U14 10(NC)* 11(NC)* 12(NC)* 14(I_AUD)* 17(IN)* 20(CLK/V_BM)*

### Notes on the sheet
- micro SD Card
- SD Power/Reset
- LED Driver
- Card Receptacle
- (near C63) Place near IC
- ESD Protection
- Sensor Load Switch
- REVISION
- DESCRIPTION
- DATE
- APPROVED
- 295 Foster St
- PROJECT
- www.odic.com <http://www.odic.com>
- Littleton, MA
- 01460
- Suite 202
- TITLE
- DRAWN:
- CHECKED:
- APPROVALS
- SIZE
- B
- PROJECT ID
- DWG NO.
- SHEET
- OF
- REV
- APPROVED:
- FILE NAME

### Library data of the parts
C62 C65 C68 = CMP-00342-1: Cap Ceramic 1uF 6.3V X5R 10% SMD 0402 85C Paper T/R; Install: POP; Max Operating Temperature: 85°C; RoHS Compliant: Yes; Number of Pins: 2; Packaging: Tape and Reel; Thickness: 0.022inch; Lead Free: Lead Free; Package Quantity: 10000; Tolerance: 10%; Height: 0.5mm; Depth: 0.5mm; Construction: Flat; Radiation Hardening: No; REACH SVHC: No SVHC; Dielectric: X5R; Resistor Type: Ceramic; Min Operating Temperature: -55°C; Series: M; Width: 0.5mm; Case/Package: 0402; Voltage Rating: 6.3V; Case Code (Imperial): 0402; Length: 1mm; Voltage Rating (DC): 6.3V; Halogen Free: Halogen Free; Termination: SMD/SMT; Mount: Surface Mount; Case Code (Metric): 1005
C63 = CMP-00369-1: as C41 on sheet Power Supplies; Packaging: Tape and Reel; Construction: Flat; Max Operating Temperature: 85°C; Case Code (Metric): 1005; Voltage Rating (DC): 25V; Min Operating Temperature: -55°C; Height: 0.5mm; Series: CL; Case/Package: 0402; Voltage: 25V; Package Quantity: 1; Radiation Hardening: No; Depth: 0.5mm; Thickness: 0.022inch; Lead Free: Lead Free; Tolerance: 10%; Length: 1mm; Mount: Surface Mount; Width: 0.02inch; Dielectric: X5R; RoHS Compliant: Yes; Voltage Rating: 25V; Case Code (Imperial): 0402
C64 = CMP-00317-1: CAP CER 1UF 16V X5R 0402; Install: POP; Tolerance: 10%; Thickness: 0.022inch; Radiation Hardening: No; Voltage Rating: 16V; Length: 1mm; Voltage: 16V; Capacitance: 1uF; Dielectric: X5R; Packaging: Tape and Reel; Contact Plating: Tin; Min Operating Temperature: -55°C; Series: CL; Depth: 0.5mm; Case Code (Imperial): 0402; Case Code (Metric): 1005; Package Quantity: 1; RoHS Compliant: Yes; Height: 0.5mm; Mount: Surface Mount; Max Operating Temperature: 85°C; Case/Package: 0402; Width: 0.02inch; Construction: Flat
C66 = CMP-00446-1: as C30 on sheet Power Supplies; Voltage: 16V; Mounting Technology: Surface Mount; Width: 0.02inch; Case Code (Metric): 1005; Package Quantity: 1; Depth: 0.5mm; RoHS Compliant: Yes; Length: 1mm; Tolerance: 10%; Radiation Hardening: No; Contact Plating: Tin; Packaging: Tape and Reel; Voltage Rating (DC): 16V; Thickness: 0.022inch; Case Code (Imperial): 0402; Case/Package: 0402; Min Operating Temperature: -55°C; Max Operating Temperature: 125°C; Voltage Rating: 16V; Height: 0.5mm; Series: CL; Material: Ceramic; Construction: Flat; Lead Free: Lead Free; Dielectric: X7R
C67 = CMP-00018-1: DNP CAP; Manufacturer: Samsung; Manufacturer Part Number: CL10B104KB8NNWC; Value: .1uF; Tolerance: 10%; Voltage Rating: 50V; Dielectric: X7R; Odic Footprint: C0603; ComponentLink1URL: https://datasheet.ciiva.com/6277/s0717e-6277799.pdf?src-supplier=Digi-Key; ComponentLink1Description: https://datasheet.ciiva.com/6277/s0717e-6277799.pdf?src-supplier=Digi-Key; ComponentLink2URL: https://datasheet.ciiva.com/6277/s0717e-6277800.pdf?src-supplier=Digi-Key; ComponentLink2Description: https://datasheet.ciiva.com/6277/s0717e-6277800.pdf?src-supplier=Digi-Key; ComponentLink3URL: https://datasheet.ciiva.com/6277/s0717e-6277801.pdf?src-supplier=Digi-Key; ComponentLink3Description: https://datasheet.ciiva.com/6277/s0717e-6277801.pdf?src-supplier=Digi-Key; Supplier 1: Digi-Key; Supplier Part Number 1: 1276-1935-1-ND; RoHS: Yes; Category: Ceramic Capacitors; Stock 1: 1643; Pricing 1: 1=0.10000, 10=0.02000, 50=0.01100, 100=0.00910, 500=0.00646, 1000=0.00508 (USD); Mount: Surface Mount; Case/Package: 0603; Case Code (Metric): 1608; Case Code (Imperial): 0603; Contact Plating: Tin; Min Operating Temperature: -55°C; Max Operating Temperature: 125°C; Package Quantity: 1; Packaging: Cut Tape; Termination: Wraparound; Series: CL; Construction: Flat; Length: 0.063inch; Width: 0.031inch; Thickness: 0.035inch; RoHS Compliant: Yes; ComponentLink4URL: https://datasheet.ciiva.com/25740/cl10b104kb8nnwc-25740227.pdf?src-supplier=Digi-Key; ComponentLink4Description: https://datasheet.ciiva.com/25740/cl10b104kb8nnwc-25740227.pdf?src-supplier=Digi-Key
D5 D6 = CMP-00550-6: IC USB DUAL ESD PROTEC 6TSOP; RoHS Compliant: Yes
J9 = CMP-00549-5: 9 (8 + 1) Position Secure Digital microSD SMT Right Angle Card Connector; Install: POP
LED1 LED2 = CMP-00100-4: Blue/Red/Green 100º 400/800/1000 mcd Clear Surface Mount LED Lamp; Dominant Wavelength: 465nm; Viewing Angle: 100°; Test Current: 30mA; Forward Voltage: 3.3V; Color: Blue,Green,Red; Luminous Intensity: 400mcd; Install: POP; Forward Current: 20mA; Packaging: Cut Tape; Lens Style: Clear; Package Quantity: 500; Min Operating Temperature: -40°C; RoHS Compliant: Yes; Height: 2.3mm; Case/Package: SMD/SMT; Lens Color: Clear; Width: 6mm; Max Operating Temperature: 85°C; Lead Free: Lead Free; Illumination Color: Blue,Green,Red; Mount: Surface Mount; Length: 5mm
R52-R54 R59 = CMP-00352-1: Res Thick Film 0402 10K Ohm 1% 1/16W ±100ppm/°C Molded SMD SMD T/R; Max Power Dissipation: 63mW; Install: POP; RoHS Compliant: Yes; Number of Terminations: 2; Case/Package: 0402; Case Code (Metric): 1005; Length: 0.039inch; Military Standard: Not; Size Code: 0402; Series: RC; Height: 0.016inch; Contact Plating: Tin; Features: Moisture Resistant; Width: 0.02inch; Mount: Surface Mount; Temperature Coefficient: 100ppm/°C; Package Quantity: 1; Resistor Type: Thick Film; Min Operating Temperature: -55°C; Max Operating Temperature: 155°C; Power Rating: 63mW; Tolerance: 1%; Depth: 0.5mm; Case Code (Imperial): 0402; Construction: Rectangular; Packaging: Tape and Reel; Radiation Hardening: No
R55 = CMP-00015-3: as R30 on sheet Power Supplies; Install: DNP; Odic Footprint: R0402
R56 = CMP-00723-1: Res SMD 22 Ohm 1% 1/16W 0402; Install: POP; RoHS Compliant: Yes
R57 R58 = CMP-00351-1: as R29 on sheet Power Supplies; Series: RC; Military Standard: Not; Case Code (Metric): 1005; Features: Moisture Resistant; Termination: SMD/SMT; Number of Terminations: 2; Temperature Coefficient: 100ppm/°C; Height: 0.016inch; Tolerance: 1%; Case/Package: 0402; Depth: 0.5mm; RoHS Compliant: Yes; Resistance Tolerance: 1%; Lead Free: Lead Free; Max Operating Temperature: 155°C; Min Operating Temperature: -55°C; Width: 0.02inch; Packaging: Tape and Reel; Technology: THICK FILM; Case Code (Imperial): 0402; Package Quantity: 1; REACH SVHC: No SVHC; Resistor Type: Thick Film; Max Power Dissipation: 63mW; Voltage Rating: 50V; Length: 0.039inch; Construction: Rectangular
TP6-TP10 = CMP-00021-3: Test Point Circle 30; Install: DNP
U13 = CMP-00215-5: IC LOAD SWITCH W/DIS 1.5A 4WLCSP; Interface: On/Off; On-State Resistance: 400mR; Install: POP; Output Configuration: High Side; Max Power Dissipation: 400mW; Operating Supply Voltage: 5.5V; Turn-On Delay Time: 195us; Number of Outputs: 1; Max Operating Temperature: 85°C; Series: -; Max Output Current: 1.5A; Number of Pins: 4; Halogen Free: Halogen Free; RoHS Compliant: Yes; Output Current: 1.5A; Mount: Surface Mount; Min Operating Temperature: -40°C; Packaging: Tape and Reel; Lead Free: Lead Free; Package Quantity: 3000; Power Dissipation: 400mW; Max Supply Current: 1.5A
U14 = CMP-00912-2: 6-Channel Light Effect LED Driver with I2C Interface 2.7V to 5.5V Input 20-Pin QFN T/R; Install: POP; Dimming: I²C; Output Current per Channel: 40mA; Number of Outputs: 6; Max Operating Temperature: 85°C; Case/Package: QFN; Mounting Technology: Surface Mount; Min Operating Temperature: -40°C; Max Supply Voltage: 5.5V; Packaging: Cut Tape; RoHS Compliant: Yes; Series: -
U15 = CMP-00215-5: IC LOAD SWITCH W/DIS 1.5A 4WLCSP; On-State Resistance: 400mR; Turn-On Delay Time: 195us; Install: POP; Power Dissipation: 400mW; Number of Outputs: 1; Output Configuration: High Side; Operating Supply Voltage: 5.5V; Interface: On/Off; Packaging: Tape and Reel; Max Supply Current: 1.5A; Number of Pins: 4; Package Quantity: 3000; Max Operating Temperature: 85°C; RoHS Compliant: Yes; Min Operating Temperature: -40°C; Lead Free: Lead Free; Output Current: 1.5A; Max Power Dissipation: 400mW; Mount: Surface Mount; Series: -; Max Output Current: 1.5A; Halogen Free: Halogen Free